# Altium schematic sheet Option_MotionSensor.SchDoc
size 297 x 209 mm
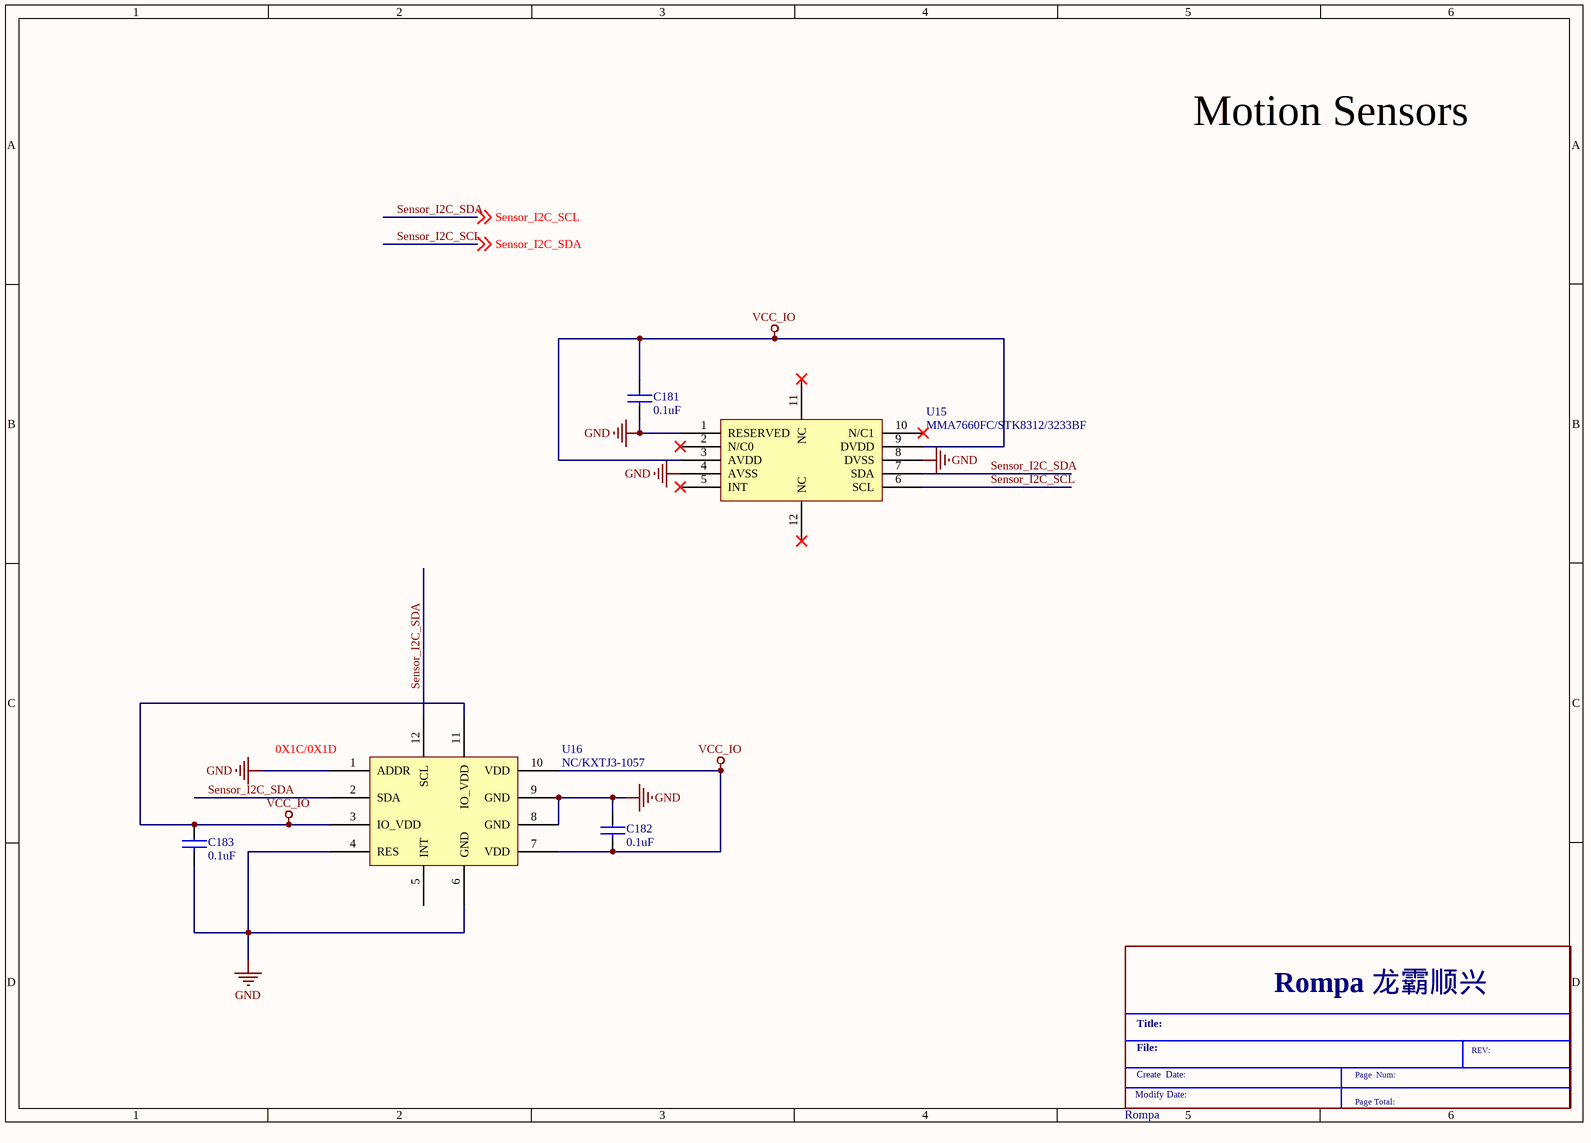
[diagram p0: Option_MotionSensor.SchDoc]

## Parts
*  Rompa  (graphical)
C181  0.1uF  [C0402]
C182  0.1uF  [C0402]
C183  0.1uF  [C0402]
U15  MMA7660FC/STK8312/3233BF
U16  NC/KXTJ3-1057

## Nets
GND: C181.2 C182.1 C183.2 U15.1(RESERVED) U15.4(AVSS) U15.8(DVSS) U16.1(ADDR) U16.4(RES) U16.6(GND) U16.8(GND) U16.9(GND)
VCC_IO: C181.1 C182.2 C183.1 U15.3(AVDD) U15.9(DVDD) U16.3(IO_VDD) U16.7(VDD) U16.10(VDD) U16.11(IO_VDD)
Sensor_I2C_SCL: U15.6(SCL) U15.7(SDA) U16.2(SDA) U16.12(SCL) ; off-sheet Sensor_I2C_SDA, off-sheet Sensor_I2C_SCL  [also labelled Sensor_I2C_SDA]

Not connected (* = marked no-connect by the designer): U15 2(N/C0)* 5(INT)* 10(N/C1)* 11(NC)* 12(NC)*; U16 5(INT)

## Notes on the sheet
- Motion Sensors
- (near U16) 0X1C/0X1D
- (in symbol Rompa) Rompa 龙霸顺兴; Title:; File:; REV:; Create  Date:; Page  Num:; Modify Date:; Page Total:

## Library data of the parts
C181-C183 = CAP NP
U15 = MMA7660FC
U16 = KXTJ3